# EAGLE design addressing-nand (EAGLE 7.7.0)
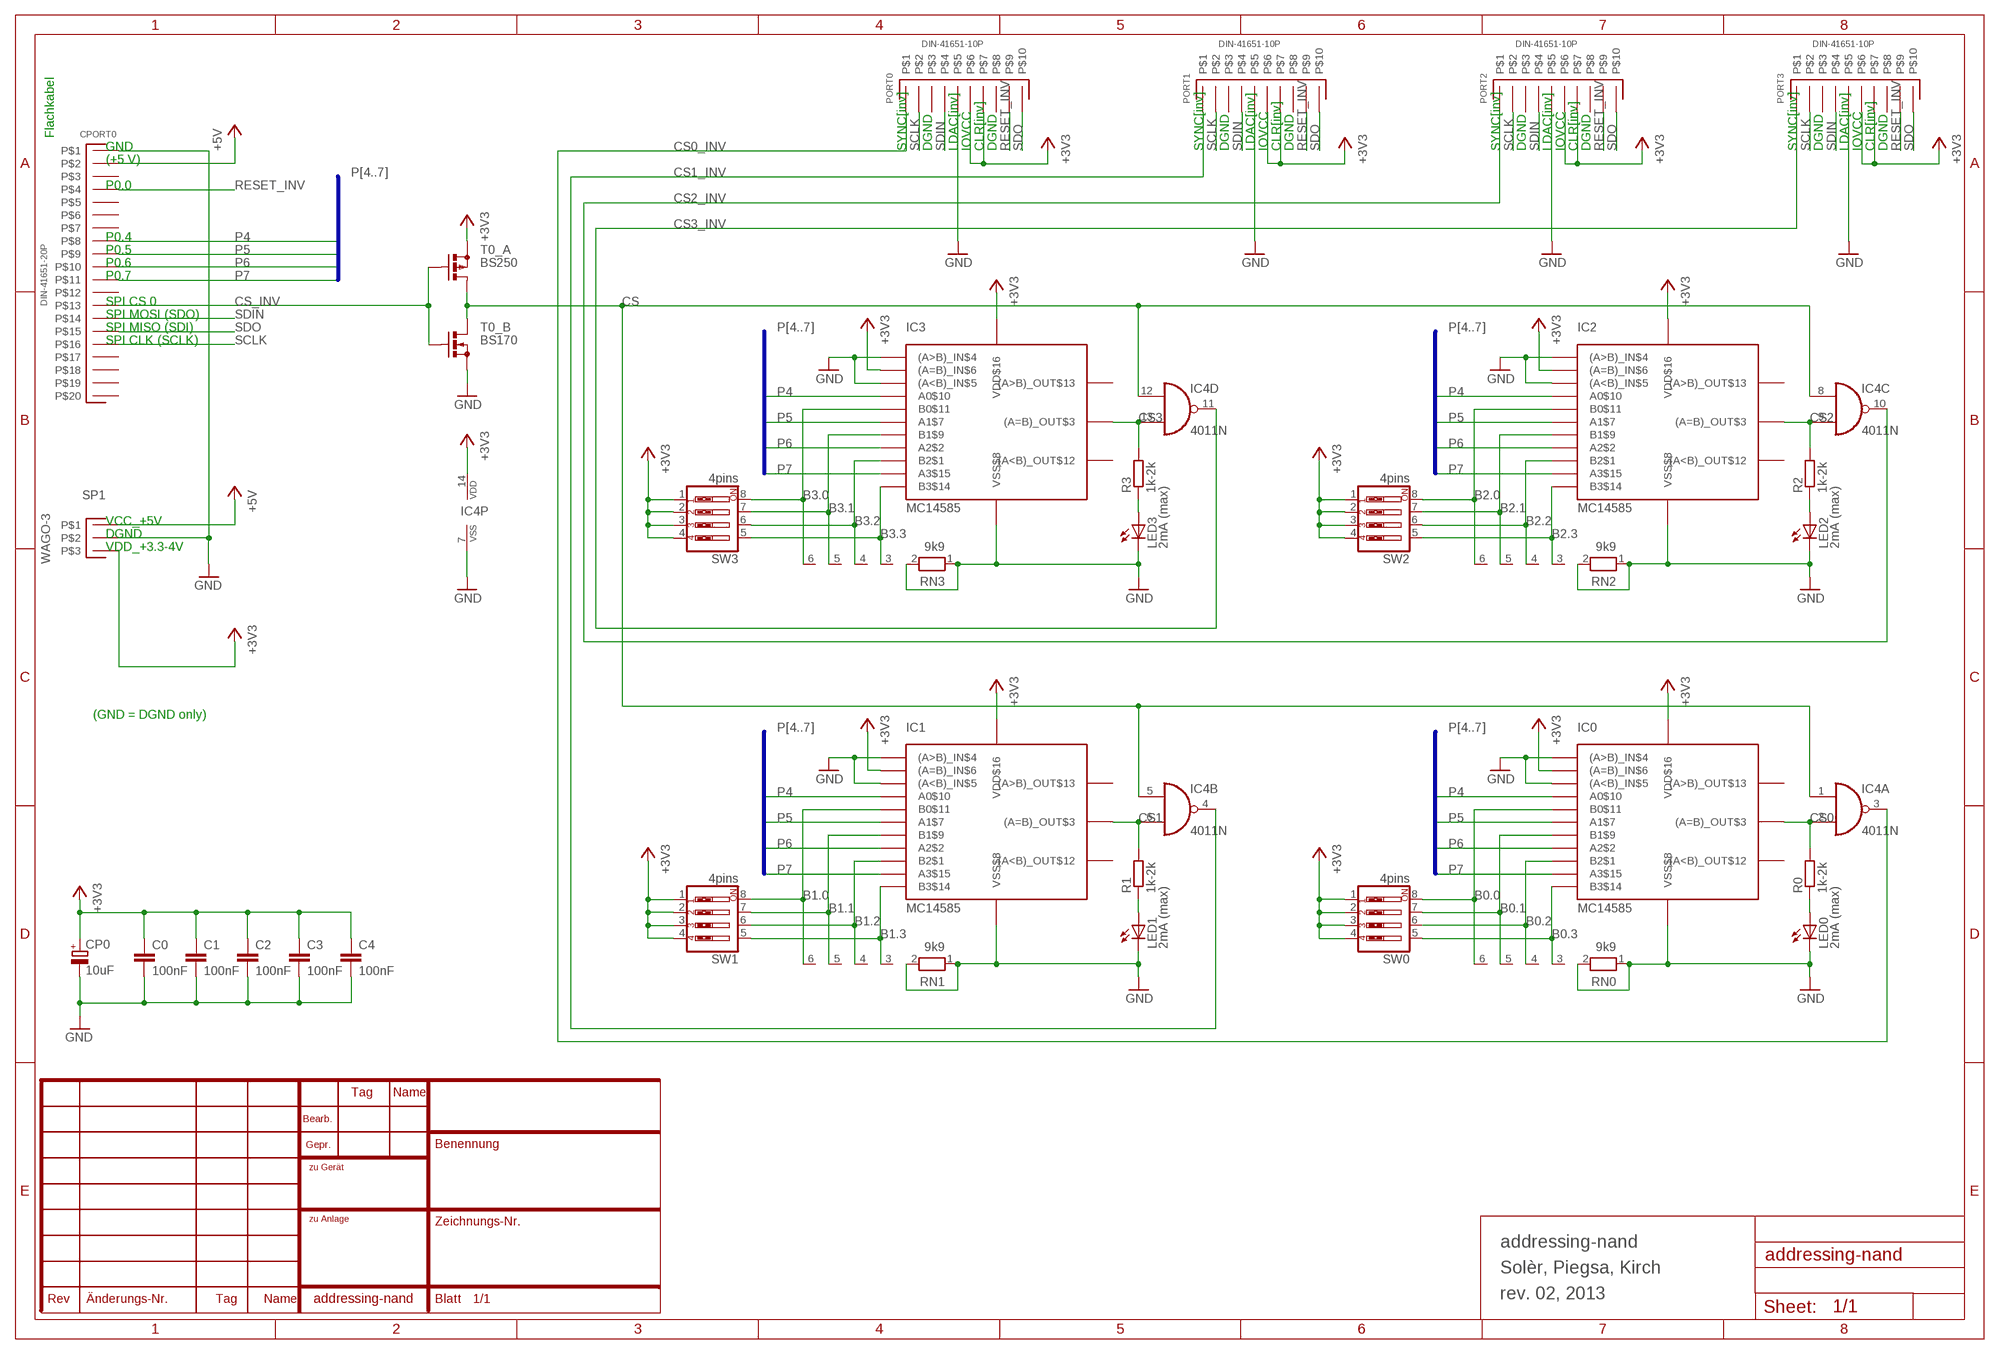
[diagram p0: schematic, sheet 1]

## Parts
C0  100nF  C-EU050-025X075  [C050-025X075]
C1  100nF  C-EU050-025X075  [C050-025X075]
C2  100nF  C-EU050-025X075  [C050-025X075]
C3  100nF  C-EU050-025X075  [C050-025X075]
C4  100nF  C-EU050-025X075  [C050-025X075]
CP0  10uF  CPOL-EUB45181B  [B45181B]
CPORT0  DIN-41651-20P  [DIN-41651-20P]
IC0  MC14585  [PDIP-16]
IC1  MC14585  [PDIP-16]
IC2  MC14585  [PDIP-16]
IC3  MC14585  [PDIP-16]
IC4  4011N  [DIL14]
LED0  2mA (max)  LED3MM  [LED3MM]
LED1  2mA (max)  LED3MM  [LED3MM]
LED2  2mA (max)  LED3MM  [LED3MM]
LED3  2mA (max)  LED3MM  [LED3MM]
PORT0  DIN-41651-10P  [DIN-41651-10P]
PORT1  DIN-41651-10P  [DIN-41651-10P]
PORT2  DIN-41651-10P  [DIN-41651-10P]
PORT3  DIN-41651-10P  [DIN-41651-10P]
R0  1k-2k  R-EU_0207/2V  [0207/2V]
R1  1k-2k  R-EU_0207/2V  [0207/2V]
R2  1k-2k  R-EU_0207/2V  [0207/2V]
R3  1k-2k  R-EU_0207/2V  [0207/2V]
RN0  9k9  RN05  [RN-6]
RN1  9k9  RN05  [RN-6]
RN2  9k9  RN05  [RN-6]
RN3  9k9  RN05  [RN-6]
SP1  WAGO-3  [WAGO-3]
SW0  4pins  SW_DIP-4  [EDG-04]
SW1  4pins  SW_DIP-4  [EDG-04]
SW2  4pins  SW_DIP-4  [EDG-04]
SW3  4pins  SW_DIP-4  [EDG-04]
T0_A  BS250  [SOT54E]
T0_B  BS170  [SOT54E]

## Nets
+3V3: C0.1 C1.1 C2.1 C3.1 C4.1 CP0.+ IC0.(A=B)_IN$6 IC0.VDD$16 IC1.(A=B)_IN$6 IC1.VDD$16 IC2.(A=B)_IN$6 IC2.VDD$16 IC3.(A=B)_IN$6 IC3.VDD$16 IC4.14(P:VDD) PORT0.P$6 PORT0.P$7 PORT1.P$6 PORT1.P$7 PORT2.P$6 PORT2.P$7 PORT3.P$6 PORT3.P$7 SP1.P$3 SW0.1 SW0.2 SW0.3 SW0.4 SW1.1 SW1.2 SW1.3 SW1.4 SW2.1 SW2.2 SW2.3 SW2.4 SW3.1 SW3.2 SW3.3 SW3.4 T0_A.S
+5V: CPORT0.P$2 SP1.P$1
B0.0: IC0.B0$11 RN0.6 SW0.8
B0.1: IC0.B1$9 RN0.5 SW0.7
B0.2: IC0.B2$1 RN0.4 SW0.6
B0.3: IC0.B3$14 RN0.3 SW0.5
B1.0: IC1.B0$11 RN1.6 SW1.8
B1.1: IC1.B1$9 RN1.5 SW1.7
B1.2: IC1.B2$1 RN1.4 SW1.6
B1.3: IC1.B3$14 RN1.3 SW1.5
B2.0: IC2.B0$11 RN2.6 SW2.8
B2.1: IC2.B1$9 RN2.5 SW2.7
B2.2: IC2.B2$1 RN2.4 SW2.6
B2.3: IC2.B3$14 RN2.3 SW2.5
B3.0: IC3.B0$11 RN3.6 SW3.8
B3.1: IC3.B1$9 RN3.5 SW3.7
B3.2: IC3.B2$1 RN3.4 SW3.6
B3.3: IC3.B3$14 RN3.3 SW3.5
CS: IC4.1(A:I0) IC4.5(B:I0) IC4.8(C:I0) IC4.12(D:I0) T0_A.D T0_B.D
CS0: IC0.(A=B)_OUT$3 IC4.2(A:I1) R0.2
CS0_INV: IC4.3(A:O) PORT0.P$1
CS1: IC1.(A=B)_OUT$3 IC4.6(B:I1) R1.2
CS1_INV: IC4.4(B:O) PORT1.P$1
CS2: IC2.(A=B)_OUT$3 IC4.9(C:I1) R2.2
CS2_INV: IC4.10(C:O) PORT2.P$1
CS3: IC3.(A=B)_OUT$3 IC4.13(D:I1) R3.2
CS3_INV: IC4.11(D:O) PORT3.P$1
CS_INV: CPORT0.P$13 T0_A.G T0_B.G
GND: C0.2 C1.2 C2.2 C3.2 C4.2 CP0.- CPORT0.P$1 IC0.(A<B)_IN$5 IC0.(A>B)_IN$4 IC0.VSS$8 IC1.(A<B)_IN$5 IC1.(A>B)_IN$4 IC1.VSS$8 IC2.(A<B)_IN$5 IC2.(A>B)_IN$4 IC2.VSS$8 IC3.(A<B)_IN$5 IC3.(A>B)_IN$4 IC3.VSS$8 IC4.7(P:VSS) LED0.K(C) LED1.K(C) LED2.K(C) LED3.K(C) PORT0.P$5 PORT1.P$5 PORT2.P$5 PORT3.P$5 RN0.1 RN0.2 RN1.1 RN1.2 RN2.1 RN2.2 RN3.1 RN3.2 SP1.P$2 T0_B.S
N$1: LED1.A R1.1
N$2: LED0.A R0.1
N$3: LED2.A R2.1
N$4: LED3.A R3.1
P4: CPORT0.P$8 IC0.A0$10 IC1.A0$10 IC2.A0$10 IC3.A0$10
P5: CPORT0.P$9 IC0.A1$7 IC1.A1$7 IC2.A1$7 IC3.A1$7
P6: CPORT0.P$10 IC0.A2$2 IC1.A2$2 IC2.A2$2 IC3.A2$2
P7: CPORT0.P$11 IC0.A3$15 IC1.A3$15 IC2.A3$15 IC3.A3$15
RESET_INV: CPORT0.P$4 PORT0.P$9 PORT1.P$9 PORT2.P$9 PORT3.P$9
SCLK: CPORT0.P$16 PORT0.P$2 PORT1.P$2 PORT2.P$2 PORT3.P$2
SDIN: CPORT0.P$14 PORT0.P$4 PORT1.P$4 PORT2.P$4 PORT3.P$4
SDO: CPORT0.P$15 PORT0.P$10 PORT1.P$10 PORT2.P$10 PORT3.P$10
Unconnected: CPORT0.P$3 CPORT0.P$5 CPORT0.P$6 CPORT0.P$7 CPORT0.P$12 CPORT0.P$17 CPORT0.P$18 CPORT0.P$19 CPORT0.P$20 IC0.(A<B)_OUT$12 IC0.(A>B)_OUT$13 IC1.(A<B)_OUT$12 IC1.(A>B)_OUT$13 IC2.(A<B)_OUT$12 IC2.(A>B)_OUT$13 IC3.(A<B)_OUT$12 IC3.(A>B)_OUT$13 PORT0.P$3 PORT0.P$8 PORT1.P$3 PORT1.P$8 PORT2.P$3 PORT2.P$8 PORT3.P$3 PORT3.P$8

## Buses
P[4..7]

## Notes on the sheet
- Flachkabel
- GND | SYNC[inv] | DGND | LDAC[inv] | IOVCC | CLR[inv] | DGND | SYNC[inv] | DGND | LDAC[inv] | IOVCC | CLR[inv] | DGND | SYNC[inv] | DGND | LDAC[inv] | IOVCC | CLR[inv] | DGND | SYNC[inv] | DGND | LDAC[inv] | IOVCC | CLR[inv] | DGND
- (+5 V)
- P0.0
- P0.4
- P0.5
- P0.6
- P0.7
- SPI CS 0
- SPI MOSI (SDO)
- SPI MISO (SDI)
- SPI CLK (SCLK)
- VCC_+5V
- DGND
- VDD_+3.3-4V
- (GND = DGND only)
- addressing-nand
- Solèr, Piegsa, Kirch
- rev. 02, 2013

## Library data of the parts
C0 C1-C4 = rcl:C-EU: CAPACITOR, European symbol
CP0 = rcl:CPOL-EU: POLARIZED CAPACITOR, European symbol
CPORT0 = parts:DIN-41651-20P
IC0 IC1-IC3 = parts:MC14585
IC4 = 40xx:4011: Quad 2-input NAND
LED0 LED1-LED3 = led:LED: LED OSRAM: - CHIPLED LG R971, LG N971, LY N971, LG Q971, LY Q971, LO R971, LY R971 LH N974, LH R974 LS Q976, LO Q976, LY Q976 LO Q996 - Hyper CHIPLED LW Q18S LB Q993, LB Q99A, LB R99A - SideLED LS A670, LO A670, LY A670, LG A670, LP A670 LB A673, LV A673, LT A673, LW A673 LH A674 LY A675 LS A676, LA A676, LO A676, LY A676, LW A676 LS A679, LY A679, LG A679 - Hyper Micro SIDELED® LS Y876, LA Y876, LO Y876, LY Y876 LT Y87S - SmartLED LW L88C, LW L88S LB L89C, LB L89S, LG L890 LS L89K, LO L89K, LY L89K LS L896, LA L896, LO L896, LY L896 - TOPLED LS T670, LO T670, LY T670, LG T670, LP T670 LSG T670, LSP T670, LSY T670, LOP T670, LYG T670 LG T671, LOG T671, LSG T671 LB T673, LV T673, LT T673, LW T673 LH T674 LS T676, LA T676, LO T676, LY T676, LB T676, LH T676, LSB T676, LW T676 LB T67C, LV T67C, LT T67C, LS T67K, LO T67K, LY T67K, LW E67C LS E67B, LA E67B, LO E67B, LY E67B, LB E67C, LV E67C, LT E67C LW T67C LS T679, LY T679, LG T679 LS T770, LO T770, LY T770, LG T770, LP T770 LB T773, LV T773, LT T773, LW T773 LH T774 LS E675, LA E675, LY E675, LS T675 LS T776, LA T776, LO T776, LY T776, LB T776 LHGB T686 LT T68C, LB T68C - Hyper Mini TOPLED® LB M676 - Mini TOPLED Santana® LG M470 LS M47K, LO M47K, LY M47K Source: http://www.osram.convergy.de LUXEON: - LUMILED® LXK2-PW12-R00, LXK2-PW12-S00, LXK2-PW14-U00, LXK2-PW14-V00 LXK2-PM12-R00, LXK2-PM12-S00, LXK2-PM14-U00 LXK2-PE12-Q00, LXK2-PE12-R00, LXK2-PE12-S00, LXK2-PE14-T00, LXK2-PE14-U00 LXK2-PB12-K00, LXK2-PB12-L00, LXK2-PB12-M00, LXK2-PB14-N00, LXK2-PB14-P00, LXK2-PB14-Q00 LXK2-PR12-L00, LXK2-PR12-M00, LXK2-PR14-Q00, LXK2-PR14-R00 LXK2-PD12-Q00, LXK2-PD12-R00, LXK2-PD12-S00 LXK2-PH12-R00, LXK2-PH12-S00 LXK2-PL12-P00, LXK2-PL12-Q00, LXK2-PL12-R00 Source: www.luxeon.com KINGBRIGHT: KA-3528ASYC Source: www.kingbright.com
PORT0 PORT1-PORT3 = parts:DIN-41651-10P
R0 R1-R3 = rcl:R-EU_: RESISTOR, European symbol
RN0 RN1-RN3 = resistor-net:RN05: RESISTOR NETWORK; OC_FARNELL: unknown; OC_NEWARK: unknown
SP1 = parts:WAGO-3
SW0 SW1-SW3 = special:SW_DIP-4: DIP SWITCH
T0_A = transistor-small-signal:BS250: P-CHANNEL MOS FET
T0_B = transistor-small-signal:BS170: N-CHANNEL MOS FET

## Board
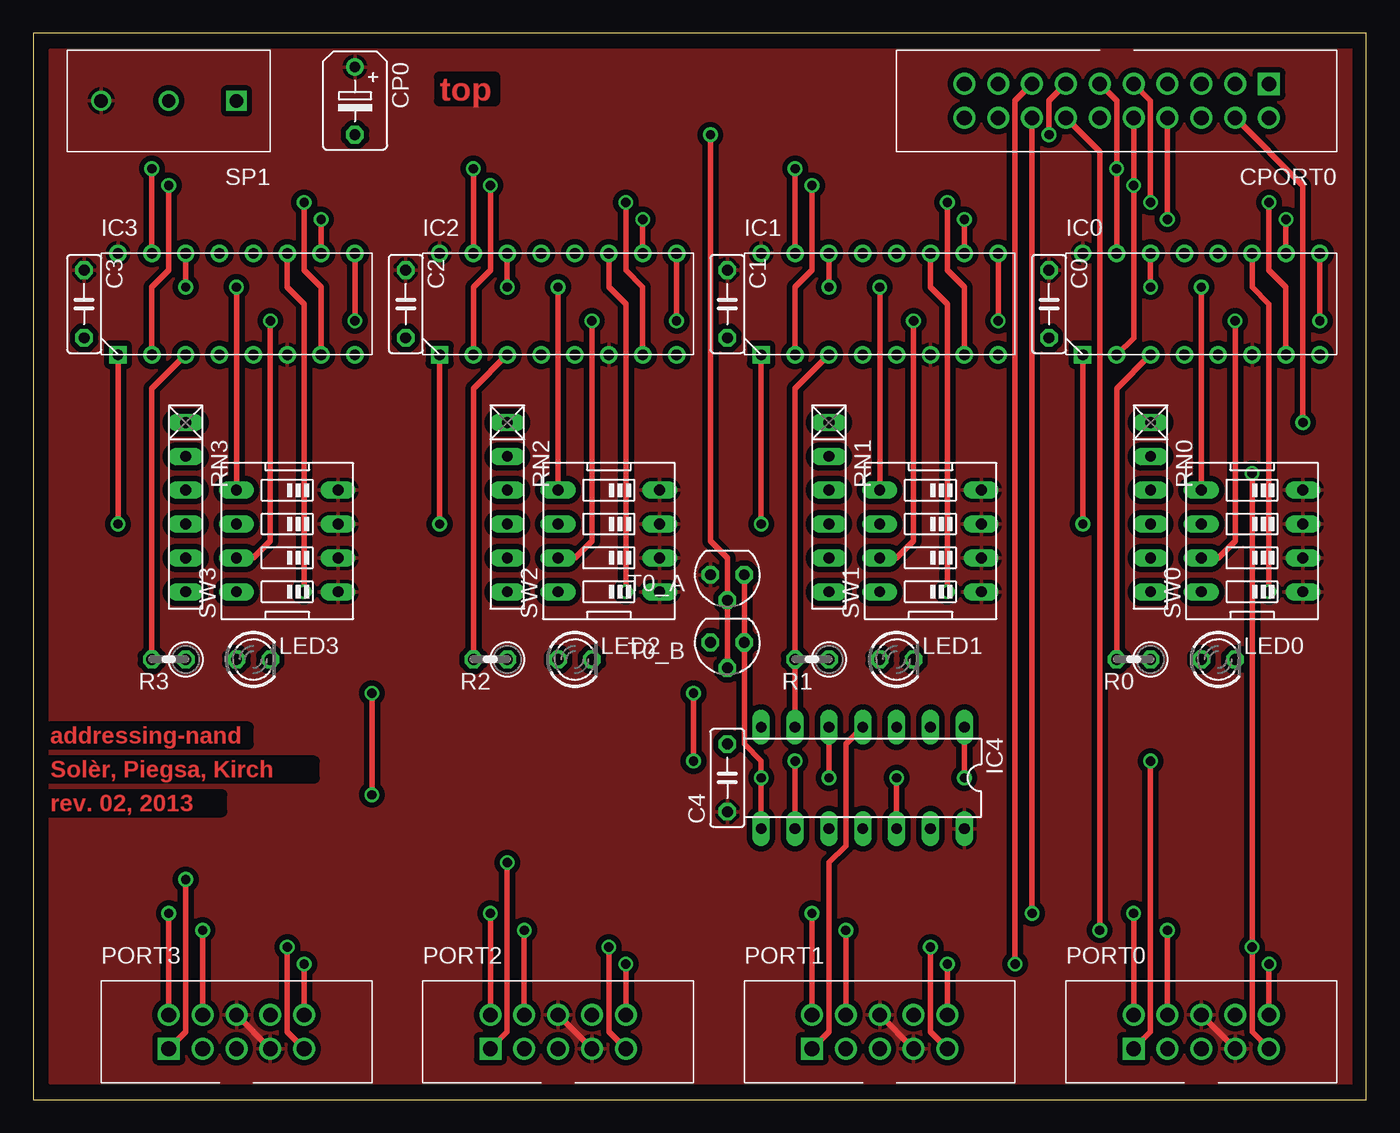
[diagram p1: board, top side]
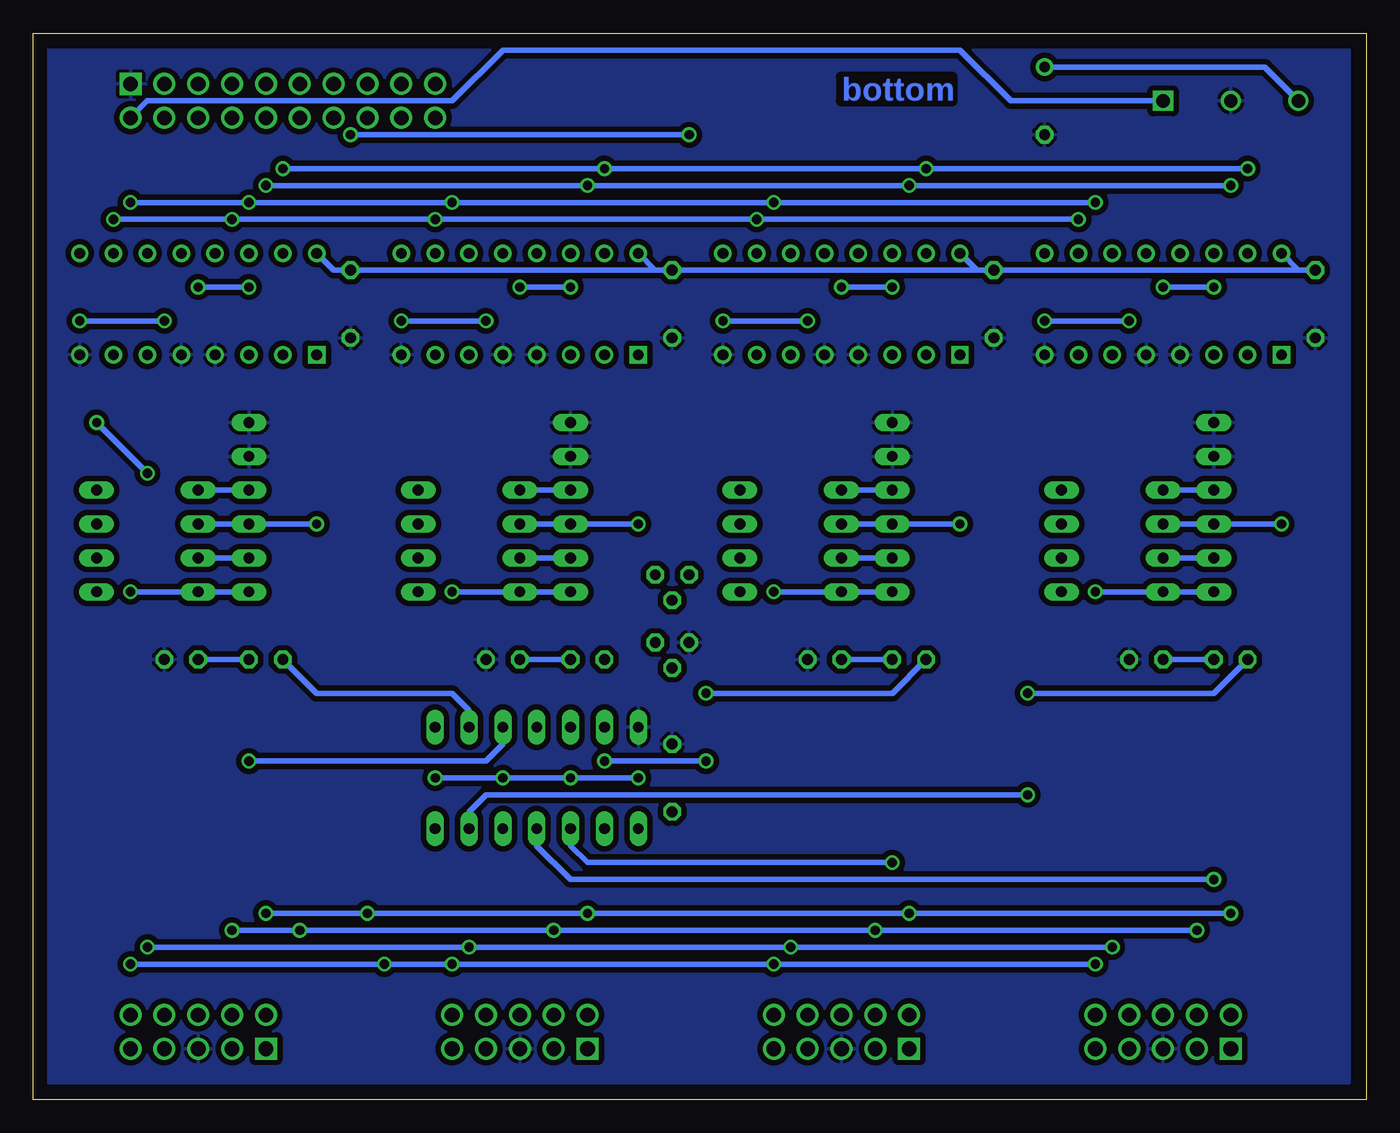
[diagram p2: board, bottom side, seen from below]

Size 100 x 80 mm. Coordinates in mm from the lower left corner, seen from the top.
Outline: 0,0 100,0 100,80 0,80 0,0
Copper layers (1*16): Top 0.035mm / dielectric 1.5mm / Bottom 0.035mm
Design rules "default": minimum track width 10mil, minimum drill 24mil, track to track 8mil, track to pad 8mil, pad to pad 8mil, via to via 8mil, smd to smd 8mil, copper to edge 40mil, drill to drill 8mil, minimum pad ring 10mil, minimum via ring 8mil, stop-mask expansion 4mil, vias tented up to drill 0mil, thermal gap 10mil

### Footprints (pad centres in the part's own frame; a part is rotated, then mirrored left to right if it is on the bottom)
C050-025X075 = drill 0.813 octagon: 1 -2.54,0; 2 2.54,0
B45181B = drill 0.813: + -2.54,0 | drill 0.813 octagon: - 2.54,0
DIN-41651-20P = drill 1.1 square: P$1 -11.43,-1.27 | drill 1.1: P$2 -11.43,1.27; P$3 -8.89,-1.27; P$4 -8.89,1.27; P$5 -6.35,-1.27; P$6 -6.35,1.27; P$7 -3.81,-1.27; P$8 -3.81,1.27; P$9 -1.27,-1.27; P$10 -1.27,1.27; P$11 1.27,-1.27; P$12 1.27,1.27; P$13 3.81,-1.27; P$14 3.81,1.27; P$15 6.35,-1.27; P$16 6.35,1.27; P$17 8.89,-1.27; P$18 8.89,1.27; P$19 11.43,-1.27; P$20 11.43,1.27
PDIP-16 = drill 0.8: (A<B)_IN$5 1.27,-3.81; (A<B)_OUT$12 1.27,3.81; (A=B)_IN$6 3.81,-3.81; (A=B)_OUT$3 -3.81,-3.81; (A>B)_IN$4 -1.27,-3.81; (A>B)_OUT$13 -1.27,3.81; A0$10 6.35,3.81; A1$7 6.35,-3.81; A2$2 -6.35,-3.81; A3$15 -6.35,3.81; B0$11 3.81,3.81; B1$9 8.89,3.81; B3$14 -3.81,3.81; VDD$16 -8.89,3.81; VSS$8 8.89,-3.81 | drill 0.8 square: B2$1 -8.89,-3.81
DIL14 = drill 0.813 long: 1 -7.62,-3.81; 2 -5.08,-3.81; 3 -2.54,-3.81; 4 0,-3.81; 5 2.54,-3.81; 6 5.08,-3.81; 7 7.62,-3.81; 8 7.62,3.81; 9 5.08,3.81; 10 2.54,3.81; 11 0,3.81; 12 -2.54,3.81; 13 -5.08,3.81; 14 -7.62,3.81
LED3MM = drill 0.813 octagon: A -1.27,0; K 1.27,0
DIN-41651-10P = drill 1.1 square: P$1 -5.08,-1.27 | drill 1.1: P$2 -5.08,1.27; P$3 -2.54,-1.27; P$4 -2.54,1.27; P$5 0,-1.27; P$6 0,1.27; P$7 2.54,-1.27; P$8 2.54,1.27; P$9 5.08,-1.27; P$10 5.08,1.27
0207/2V = drill 0.813 octagon: 1 -1.27,0; 2 1.27,0
RN-6 = drill 0.813 long: 1 -6.35,0; 2 -3.81,0; 3 -1.27,0; 4 1.27,0; 5 3.81,0; 6 6.35,0
WAGO-3 = drill 1 square: P$1 -5.08,0 | drill 1: P$2 0,0; P$3 5.08,0
EDG-04 = drill 0.813 long: 1 -3.81,-3.81; 2 -1.27,-3.81; 3 1.27,-3.81; 4 3.81,-3.81; 5 3.81,3.81; 6 1.27,3.81; 7 -1.27,3.81; 8 -3.81,3.81
SOT54E = drill 0.813 octagon: D -1.27,0; G 0,1.905; S 1.27,0

### Placement (x,y rotation side)
C0  76.2,59.69 270 top
C1  52.07,59.69 270 top
C2  27.94,59.69 270 top
C3  3.81,59.69 270 top
C4  52.07,24.13 90 top
CP0  24.13,74.93 270 top
CPORT0  81.28,74.93 180 top
IC0  87.63,59.69 0 top
IC1  63.5,59.69 0 top
IC2  39.37,59.69 0 top
IC3  15.24,59.69 0 top
IC4  62.23,24.13 180 top
LED0  88.9,33.02 0 top
LED1  64.77,33.02 0 top
LED2  40.64,33.02 0 top
LED3  16.51,33.02 0 top
PORT0  87.63,5.08 0 top
PORT1  63.5,5.08 0 top
PORT2  39.37,5.08 0 top
PORT3  15.24,5.08 0 top
R0  82.55,33.02 180 top
R1  58.42,33.02 180 top
R2  34.29,33.02 180 top
R3  10.16,33.02 180 top
RN0  83.82,44.45 270 top
RN1  59.69,44.45 270 top
RN2  35.56,44.45 270 top
RN3  11.43,44.45 270 top
SP1  10.16,74.93 180 top
SW0  91.44,41.91 90 top
SW1  67.31,41.91 90 top
SW2  43.18,41.91 90 top
SW3  19.05,41.91 90 top
T0_A  52.07,39.37 180 top
T0_B  52.07,34.29 180 top

### Tracks (layer width: path | path; a pad name or v marks a point on that pad's centre or on a via)
+3V3
  Top 0.406: PORT3.P$6 PORT3.P$7 | PORT2.P$6 PORT2.P$7 | PORT1.P$6 PORT1.P$7 | PORT0.P$6 PORT0.P$7
  Bottom 0.406: SP1.P$3 7.62,77.47 CP0.+ | 53.34,62.23 C1.1 C2.1 | 53.34,62.23 C0.1 77.47,62.23 IC0.VDD$16 | 53.34,62.23 IC1.VDD$16 | C2.1 C3.1 5.08,62.23 IC3.VDD$16 | C2.1 29.21,62.23 IC2.VDD$16
  pour Top (isolate 0.406): 1.27,78.74 99.06,78.74 99.06,1.27 1.27,1.27
+5V
  Bottom 0.406: CPORT0.P$2 91.44,74.93 68.58,74.93 64.77,78.74 30.48,78.74 26.67,74.93 SP1.P$1
B0.0  (via drill 0.7)
  Top 0.406: IC0.B0$11 91.44,60.96 92.71,59.69 v92.71,38.1
  Bottom 0.406: RN0.6 SW0.8 v92.71,38.1
B0.1  (via drill 0.7)
  Top 0.406: v96.52,58.42 IC0.B1$9 | v90.17,58.42 90.17,41.91 88.9,40.64 SW0.7
  Bottom 0.406: v90.17,58.42 v96.52,58.42 | RN0.5 SW0.7
B0.2  (via drill 0.7)
  Top 0.406: v78.74,43.18 IC0.B2$1
  Bottom 0.406: SW0.6 RN0.4 v78.74,43.18
B0.3  (via drill 0.7)
  Top 0.406: v83.82,60.96 IC0.B3$14 | SW0.5 v87.63,60.96
  Bottom 0.406: v87.63,60.96 v83.82,60.96 | RN0.3 SW0.5
B1.0  (via drill 0.7)
  Top 0.406: IC1.B0$11 67.31,60.96 68.58,59.69 v68.58,38.1
  Bottom 0.406: v68.58,38.1 SW1.8 RN1.6
B1.1  (via drill 0.7)
  Top 0.406: v72.39,58.42 IC1.B1$9 | SW1.7 64.77,40.64 66.04,41.91 v66.04,58.42
  Bottom 0.406: v66.04,58.42 v72.39,58.42 | RN1.5 SW1.7
B1.2  (via drill 0.7)
  Top 0.406: v54.61,43.18 IC1.B2$1
  Bottom 0.406: v54.61,43.18 RN1.4 SW1.6
B1.3  (via drill 0.7)
  Top 0.406: v59.69,60.96 IC1.B3$14 | SW1.5 v63.5,60.96
  Bottom 0.406: v63.5,60.96 v59.69,60.96 | RN1.3 SW1.5
B2.0  (via drill 0.7)
  Top 0.406: IC2.B0$11 43.18,60.96 44.45,59.69 v44.45,38.1
  Bottom 0.406: v44.45,38.1 SW2.8 RN2.6
B2.1  (via drill 0.7)
  Top 0.406: v48.26,58.42 IC2.B1$9 | v41.91,58.42 41.91,41.91 40.64,40.64 SW2.7
  Bottom 0.406: v41.91,58.42 v48.26,58.42 | RN2.5 SW2.7
B2.2  (via drill 0.7)
  Top 0.406: v30.48,43.18 IC2.B2$1
  Bottom 0.406: v30.48,43.18 RN2.4 SW2.6
B2.3  (via drill 0.7)
  Top 0.406: v35.56,60.96 IC2.B3$14 | SW2.5 v39.37,60.96
  Bottom 0.406: v39.37,60.96 v35.56,60.96 | RN2.3 SW2.5
B3.0  (via drill 0.7)
  Top 0.406: IC3.B0$11 19.05,60.96 20.32,59.69 v20.32,38.1
  Bottom 0.406: v20.32,38.1 SW3.8 RN3.6
B3.1  (via drill 0.7)
  Top 0.406: v24.13,58.42 IC3.B1$9 | v17.78,58.42 17.78,41.91 16.51,40.64 SW3.7
  Bottom 0.406: v17.78,58.42 v24.13,58.42 | RN3.5 SW3.7
B3.2  (via drill 0.7)
  Top 0.406: v6.35,43.18 IC3.B2$1
  Bottom 0.406: v6.35,43.18 RN3.4 SW3.6
B3.3  (via drill 0.7)
  Top 0.406: v11.43,60.96 IC3.B3$14 | SW3.5 v15.24,60.96
  Bottom 0.406: v15.24,60.96 v11.43,60.96 | RN3.3 SW3.5
CS  (via drill 0.7)
  Top 0.406: v69.85,24.13 IC4.1 | IC4.8 v54.61,24.13 54.61,25.4 53.34,26.67 T0_B.D T0_A.D | v64.77,24.13 IC4.12 | v59.69,24.13 IC4.5
  Bottom 0.406: v54.61,24.13 v59.69,24.13 v64.77,24.13 v69.85,24.13
CS0
  Top 0.406: IC0.(A=B)_OUT$3 81.28,53.34 R0.2
  Bottom 0.406: R0.2 78.74,30.48 68.58,30.48 67.31,29.21 IC4.2
CS0_INV  (via drill 0.7)
  Top 0.406: v83.82,25.4 83.82,5.08 PORT0.P$1
  Bottom 0.406: v83.82,25.4 66.04,25.4 64.77,26.67 IC4.3
CS1
  Top 0.406: IC1.(A=B)_OUT$3 57.15,53.34 R1.2 IC4.6
CS1_INV
  Top 0.406: PORT1.P$1 59.69,5.08 59.69,17.78 60.96,19.05 60.96,26.67 IC4.4
CS2  (via drill 0.7)
  Top 0.406: IC2.(A=B)_OUT$3 33.02,53.34 R2.2 | v49.53,30.48 v49.53,25.4 | v57.15,25.4 IC4.9
  Bottom 0.406: v49.53,30.48 35.56,30.48 R2.2 | v49.53,25.4 v57.15,25.4
CS2_INV  (via drill 0.7)
  Top 0.406: PORT2.P$1 35.56,5.08 v35.56,17.78
  Bottom 0.406: v35.56,17.78 58.42,17.78 59.69,19.05 IC4.10
CS3  (via drill 0.7)
  Top 0.406: v25.4,30.48 v25.4,22.86 | IC3.(A=B)_OUT$3 8.89,53.34 R3.2
  Bottom 0.406: v25.4,22.86 66.04,22.86 67.31,21.59 IC4.13 | v25.4,30.48 11.43,30.48 R3.2
CS3_INV  (via drill 0.7)
  Top 0.406: PORT3.P$1 11.43,5.08 v11.43,16.51
  Bottom 0.406: IC4.11 62.23,19.05 59.69,16.51 v11.43,16.51
CS_INV  (via drill 0.7)
  Top 0.406: CPORT0.P$13 76.2,74.93 v76.2,72.39 | v50.8,72.39 50.8,41.91 52.07,40.64 T0_A.G T0_B.G
  Bottom 0.406: v50.8,72.39 v76.2,72.39
GND
  pour Bottom (isolate 0.406): 1.27,78.74 99.06,78.74 99.06,1.27 1.27,1.27
N$1
  Bottom 0.406: R1.1 LED1.A
N$2
  Bottom 0.406: R0.1 LED0.A
N$3
  Bottom 0.406: R2.1 LED2.A
N$4
  Bottom 0.406: R3.1 LED3.A
P4  (via drill 0.7)
  Top 0.406: v85.09,66.04 CPORT0.P$8 | v93.98,66.04 IC0.A0$10 | IC3.A0$10 v21.59,66.04 | v45.72,66.04 IC2.A0$10 | v69.85,66.04 IC1.A0$10
  Bottom 0.406: v93.98,66.04 v85.09,66.04 v69.85,66.04 v45.72,66.04 v21.59,66.04
P5  (via drill 0.7)
  Top 0.406: CPORT0.P$9 83.82,74.93 v83.82,67.31 | v92.71,67.31 92.71,62.23 93.98,60.96 IC0.A1$7 | v20.32,67.31 20.32,62.23 21.59,60.96 IC3.A1$7 | IC1.A1$7 69.85,60.96 68.58,62.23 v68.58,67.31 | IC2.A1$7 45.72,60.96 44.45,62.23 v44.45,67.31
  Bottom 0.406: v92.71,67.31 v83.82,67.31 v68.58,67.31 v44.45,67.31 v20.32,67.31
P6  (via drill 0.7)
  Top 0.406: IC0.A2$2 82.55,57.15 v82.55,68.58 CPORT0.P$10 | v58.42,68.58 58.42,62.23 57.15,60.96 IC1.A2$2 | v34.29,68.58 34.29,62.23 33.02,60.96 IC2.A2$2 | v10.16,68.58 10.16,62.23 8.89,60.96 IC3.A2$2
  Bottom 0.406: v82.55,68.58 v58.42,68.58 v34.29,68.58 v10.16,68.58
P7  (via drill 0.7)
  Top 0.406: CPORT0.P$11 81.28,74.93 v81.28,69.85 IC0.A3$15 | v33.02,69.85 IC2.A3$15 | IC3.A3$15 v8.89,69.85 | v57.15,69.85 IC1.A3$15
  Bottom 0.406: v8.89,69.85 v33.02,69.85 v57.15,69.85 v81.28,69.85
RESET_INV  (via drill 0.7)
  Top 0.406: v91.44,46.99 v91.44,11.43 91.44,5.08 PORT0.P$9 | v95.25,50.8 95.25,68.58 CPORT0.P$4 | v67.31,11.43 67.31,5.08 PORT1.P$9 | PORT2.P$9 43.18,5.08 v43.18,11.43 | PORT3.P$9 19.05,5.08 v19.05,11.43
  Bottom 0.406: v91.44,46.99 v95.25,50.8 | v91.44,11.43 v67.31,11.43 v43.18,11.43 v19.05,11.43
SCLK  (via drill 0.7)
  Top 0.406: v74.93,13.97 CPORT0.P$16 | v82.55,13.97 PORT0.P$2 | v34.29,13.97 PORT2.P$2 | PORT3.P$2 v10.16,13.97 | v58.42,13.97 PORT1.P$2
  Bottom 0.406: v82.55,13.97 v74.93,13.97 v58.42,13.97 v34.29,13.97 v10.16,13.97
SDIN  (via drill 0.7)
  Top 0.406: v80.01,12.7 80.01,71.12 CPORT0.P$14 | v85.09,12.7 PORT0.P$4 | v36.83,12.7 PORT2.P$4 | PORT3.P$4 v12.7,12.7 | v60.96,12.7 PORT1.P$4
  Bottom 0.406: v85.09,12.7 v80.01,12.7 v60.96,12.7 v36.83,12.7 v12.7,12.7
SDO  (via drill 0.7)
  Top 0.406: CPORT0.P$15 73.66,74.93 v73.66,10.16 | v92.71,10.16 PORT0.P$10 | v68.58,10.16 PORT1.P$10 | v44.45,10.16 PORT2.P$10 | PORT3.P$10 v20.32,10.16
  Bottom 0.406: v92.71,10.16 v73.66,10.16 v68.58,10.16 v44.45,10.16 v20.32,10.16

### Text on the board
Top: top | addressing-nand | Solèr, Piegsa, Kirch | rev. 02, 2013
Bottom: bottom